# Altium schematic sheet pca64110.SchDoc: PCA64110 - NFC antenna flexprint
size A4; Revision: 1.0.0; SheetNumber: 1; SheetTotal: 1; Author: TORS; DrawnBy: TORS; ProjectNumber: 4397; DocumentSize: A4; PCBRevision: 0018TORS; PCAName: PCA64110; PCBNumber: 400148
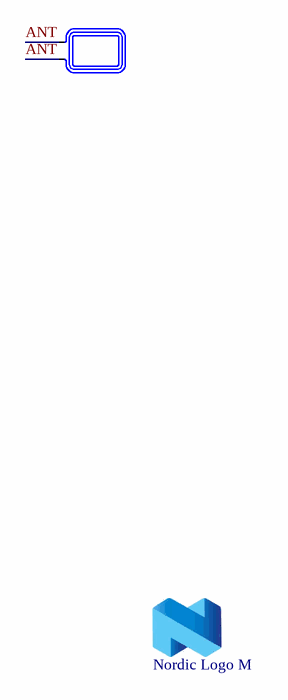
[diagram p0: pca64110.SchDoc]

## Parts
A1  NFC_ANT_Listener-6  [NFC_ANT_Listener-6]  (value not drawn)  (no BOM)
LOGO1  Nordic Logo M  [NORDIC_LOGO_M]  (no BOM)

## Nets
ANT: A1.1 A1.2

## Notes on the sheet
- Title
- Size
- Date:
- Project Number
- Sheet         of
- Revision
- File:
- Drawn By:

## Library data of the parts
A1 = NFC_ANT_Listener-6: NFC Antenna Listener-6; Artikkelnr Noca: N.A.; Part Number: NFC_ANT_Listener-6; Manufacturer: *; Manufacturer Part Number: *; Datasheet: *; Footprint Doc: NFC_ANT_Listener-6; LatestRevisionDate: 2015-05-29; Pin Count: 2; Publisher: Nordic Semiconductor; Published: 2015-05-29; Value: NFC_ANT_Listener-6; Note: *; Supplier: *; Supplier part number: *; 2nd source Supplier: *; 2nd source part number: *; Artikkelnr Simpro: N.A.
LOGO1 = Nordic Logo M: Nordic Logo, medium size; Artikkelnr Noca: N.A.; Part Number: Nordic Logo M; Manufacturer: *; Manufacturer Part Number: *; Datasheet: *; LatestRevisionDate: 2010-02-18; Publisher: Nordic Semiconductor; Value: Nordic Logo M; Note: *; Supplier: *; Supplier part number: *; 2nd source Supplier: *; 2nd source part number: *; Pin Count: 2; Published: 2010-02-18